# Altium schematic sheet Sheet_MPU9150_IMU.SchDoc
size 177 x 88 mm
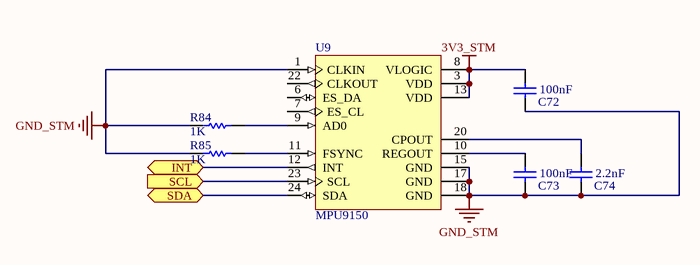
[diagram p0: Sheet_MPU9150_IMU.SchDoc]

## Parts
C72  100nF  [1608[0603]]
C73  100nF  [1608[0603]]
C74  2.2nF  [1608[0603]]
R84  1K  [1608[0603]]
R85  1K  [1608[0603]]
U9  MPU9150  [QFN24]

## Ports
INT, SCL (in), SDA (bidir)

## Nets
3V3_STM: C72.2 U9.3(VDD) U9.8(VLOGIC) U9.13(VDD)
GND_STM: C72.1 C73.1 C74.1 R84.1 R85.1 U9.1(CLKIN) U9.15(GND) U9.17(GND) U9.18(GND)
INT: U9.12(INT) ; port INT
SCL: U9.23(SCL) ; port SCL
SDA: U9.24(SDA) ; port SDA
NetC73_2: C73.2 U9.10(REGOUT)
NetC74_2: C74.2 U9.20(CPOUT)
NetR84_2: R84.2 U9.9(AD0)
NetR85_2: R85.2 U9.11(FSYNC)

Not connected (* = marked no-connect by the designer): U9 6(ES_DA) 7(ES_CL) 22(CLKOUT)

## Library data of the parts
C72-C74 = Cap_BP: Capacitor; Supplier 1: Digi-Key
  C72 C73: Value: 100nF; Supplier Part Number 1: 311-1088-1-ND
  C74: Value: 2.2nF; Supplier Part Number 1: 490-1459-1-ND
R84 R85 = Res: Value: 1K; Supplier 1: Digi-Key; Supplier Part Number 1: P1.0KGCT-ND
U9 = MPU9150: 9-DOF IMU; Rule: UNIONINDEX{}0[]RULEKIND{}Clearance[]NETSCOPE{}DifferentNets[]LAYERKIND{}SameLayer[]NAME{}Schematic Clearance Constraint[]GAP{}5mil[]GENERICCLEARANCE{}5mil[]OBJECTCLEARANCES{} []UNIT{}Imperial[]PcbType{}ProtelPcb; Supplier 1: Digi-Key; Supplier Part Number 1: 1428-1009-1-ND